# Altium project Sim800.PrjPcb
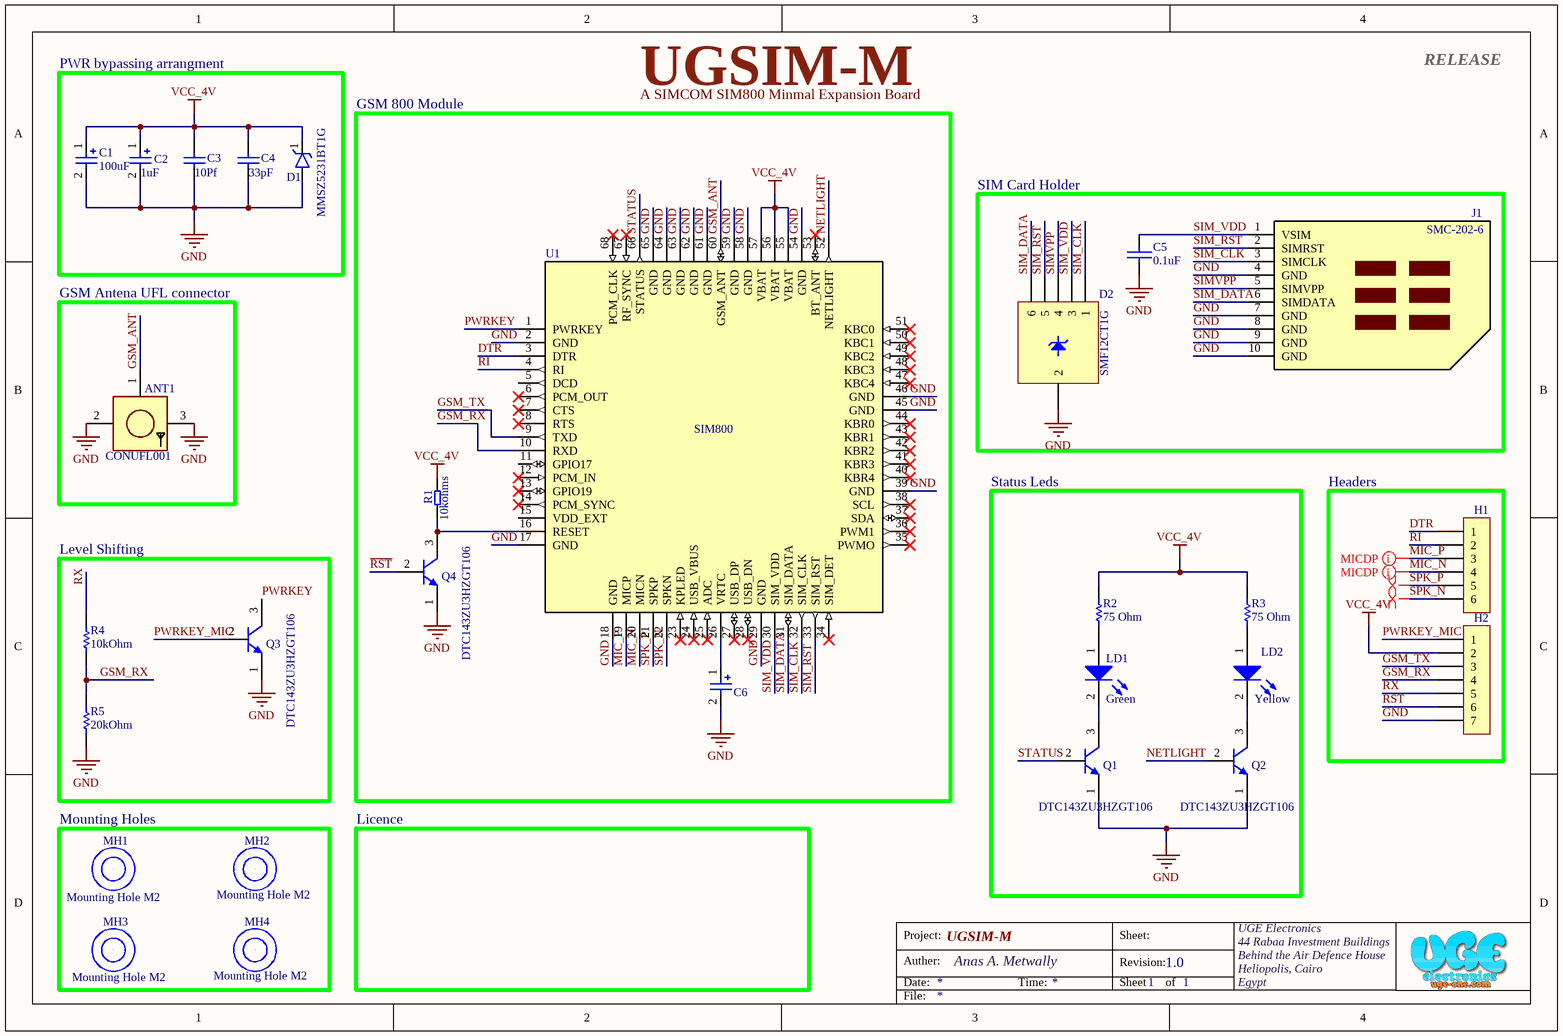
[diagram p0: Sim800.SchDoc]
1 sheet, 28 parts. Net scope: global (net labels, ports and power ports of the same name join across sheets).
Board file: sim800.PcbDoc

## Sheet Sim800.SchDoc: UGSIM-M
size A4; Author: Anas A.metwally; DrawnBy: Anas A.Metwally; Engineer: Anas A.Metwally; Organization: UGE Electronics; Address1: 44 Rabaa Investment Buildings; Address2: Behind the Air Defence House; Address3: Heliopolis, Cairo; Address4: Egypt; Revision: 1.0; SheetNumber: 1; SheetTotal: 1; Design Status: RELEASE

### Parts
ANT1  CONUFL001  [UFL]
C1  100uF  [Tanat Case D]
C2  1uF  [C1206]
C3  10Pf  [0603Cap]
C4  33pF
C5  0.1uF  [0603Cap]
C6  4.7uF  [C1206]  (value not drawn)
D1  MMSZ5231BT1G  [SOD-123]
D2  SMF12CT1G  [SOT-363]
H1  Heder 6X1  [Header6X1]  (value not drawn)
H2  Heder 7X1  [Header 7X1]  (value not drawn)
J1  SMC-202-6  [Micro SIM Connector]
LD1  Green  [0603D-G]
LD2  Yellow  [0603D-y]
MH1  Mounting Hole M2  [M2Hole]  (no BOM)
MH2  Mounting Hole M2  [M2Hole]  (no BOM)
MH3  Mounting Hole M2  [M2Hole]  (no BOM)
MH4  Mounting Hole M2  [M2Hole]  (no BOM)
Q1  DTC143ZU3HZGT106  [Sot 323]
Q2  DTC143ZU3HZGT106  [Sot 323]
Q3  DTC143ZU3HZGT106  [Sot 323]
Q4  DTC143ZU3HZGT106  [Sot 323]
R1  10kohms  [0603R]
R2  75 Ohm  [0603R]
R3  75 Ohm  [0603R]
R4  10kOhm  [0603R]
R5  20kOhm  [0603R]
U1  SIM800  [SIMCom_SIM800]

### Blocks framed on the sheet
PWR bypassing arrangment: C1-C4 D1
SIM Card Holder: C5 D2 J1
GSM Antena UFL connector: ANT1
Status Leds: LD1 LD2 Q1 Q2 R2 R3
Headers: H1 H2
Level Shifting: Q3 R4 R5
Mounting Holes: MH1-MH4

### Nets
GND: ANT1.2 ANT1.3 C1.2 C2.2 C3.1 C4.1 C5.2 C6.2 D1.2 D2.2 H2.7 J1.4(GND) J1.7(GND) J1.8(GND) J1.9(GND) J1.10(GND) Q1.1(E) Q2.1(E) Q3.1(E) Q4.1(E) R5.1 U1.2(GND) U1.17(GND) U1.18(GND) U1.29(GND) U1.39(GND) U1.45(GND) U1.46(GND) U1.54(GND) U1.58(GND) U1.59(GND) U1.61(GND) U1.62(GND) U1.63(GND) U1.64(GND) U1.65(GND)
VCC_4V: C1.1 C2.1 C3.2 C4.2 D1.1 H2.2 R1.2 R2.1 R3.1 U1.55(VBAT) U1.56(VBAT) U1.57(VBAT)
~{RST}: H2.6 Q4.2(B)
DTR: H1.1 U1.3(DTR)
GSM_ANT: ANT1.1 U1.60(GSM_ANT)
GSM_RX: H2.4 R4.1 R5.2 U1.10(RXD)
GSM_TX: H2.3 U1.9(TXD)
MIC_N: H1.4 U1.20(MICN)
MIC_P: H1.3 U1.19(MICP)
NETLIGHT: Q2.2(B) U1.52(NETLIGHT)
PWRKEY: Q3.3(C) U1.1(PWRKEY)
PWRKEY_MIC: H2.1 Q3.2(B)
RI: H1.2 U1.4(RI)
RX: H2.5 R4.2
SIM_CLK: D2.1 J1.3(SIMCLK) U1.32(SIM_CLK)
SIM_DATA: D2.6 J1.6(SIMDATA) U1.31(SIM_DATA)
SIM_RST: D2.5 J1.2(SIMRST) U1.33(SIM_RST)
SIM_VDD: C5.1 D2.3 J1.1(VSIM) U1.30(SIM_VDD)
SIMVPP: D2.4 J1.5(SIMVPP)
SPK_N: H1.6 U1.22(SPKN)
SPK_P: H1.5 U1.21(SPKP)
STATUS: Q1.2(B) U1.66(STATUS)
NetC6_1: C6.1 U1.26(VRTC)
NetLD1_1: LD1.1(A) R2.2
NetLD1_2: LD1.2(K) Q1.3(C)
NetLD2_1: LD2.1(A) R3.2
NetLD2_2: LD2.2(K) Q2.3(C)
NetQ4_3: Q4.3(C) R1.1 U1.16(RESET)

Not connected (* = marked no-connect by the designer): MH1 0; MH2 0; MH3 0; MH4 0; U1 5(DCD) 6(PCM_OUT)* 7(CTS)* 8(RTS)* 11(GPIO17) 12(PCM_IN)* 13(GPIO19)* 14(PCM_SYNC)* 15(VDD_EXT) 23(KPLED)* 24(USB_VBUS)* 25(ADC)* 27(USB_DP)* 28(USB_DN)* 34(SIM_DET)* 35(PWMO)* 36(PWM1)* 37(SDA)* 38(SCL)* 40(KBR4)* 41(KBR3)* 42(KBR2)* 43(KBR1)* 44(KBR0)* 47(KBC4)* 48(KBC3)* 49(KBC2)* 50(KBC1)* 51(KBC0)* 53(BT_ANT)* 67(RF_SYNC)* 68(PCM_CLK)*

### Layout directives
differential pair: MIC_N, MIC_P, SPK_N, SPK_P

### Notes on the sheet
- GSM 800 Module
- A SIMCOM SIM800 Minmal Expansion Board
- Licence
- Project:
- Auther:
- Date:
- Anas A. Metwally <anastien@outlook.com>
- Time:
- Sheet:
- Revision:
- Sheet
- of
- UGE Electronics <https://uge-one.com/>
- 44 Rabaa Investment Buildings
- Behind the Air Defence House
- Heliopolis, Cairo
- Egypt
- File:

### Library data of the parts
ANT1 = CONUFL001-SMD-T: CONN UMC JACK STR SMD; Manufacturer: Linx; Supplier 1: Mouser; Manufacturer Part Number: CONUFL001-SMD-T; Stock 1: 8451; Pricing 1: 1 = 0.62000, 10 = 0.59000, 50 = 0.57000, 100 = 0.53000, 1000 = 0.44000, 10000 = 0.37800 (USD); RoHS: No; ComponentLink1URL: https://media.digikey.com/pdf/Data%20Sheets/Linx%20Technologies%20PDFs/CONUFL001-SMD_T_Dwg_RevB_5-15-17.pdf?src-supplier=Digi-Key; ComponentLink1Description: https://media.digikey.com/pdf/Data%20Sheets/Linx%20Technologies%20PDFs/CONUFL001-SMD_T_Dwg_RevB_5-15-17.pdf?src-supplier=Digi-Key; Supplier Part Number 1: 712-CONUFL001-SMD-T
C1 = Cap 100uF Tant: Manufacturer: Kyocera AVX; Manufacturer Part Number: TAJA105K035TNJ; Voltage Rating (DC): 25V; Tolerance: 20%; Stock 1: 22047; Pricing 1: 1 = 0.43000, 10 = 0.29700, 50 = 0.29700, 100 = 0.13400, 1000 = 0.11300, 2000 = 0.09300, 10000 = 0.09300 (USD); RoHS: No; ComponentLink1URL: http://datasheets.avx.com/TAJ_AUTO.pdf?src-supplier=Digi-Key; ComponentLink1Description: http://datasheets.avx.com/TAJ_AUTO.pdf?src-supplier=Digi-Key; Stock 2: 1935; Pricing 2: 1 = 3.18000, 10 = 2.57000, 50 = 2.57000, 100 = 1.96000, 250 = 1.59000, 500 = 1.46000, 1000 = 1.28000, 1500 = 1.10000, 4500 = 1.06000, 9000 = 1.05000, 10000 = 1.06000 (USD); Capacitance: 100uF; Lead Free: Lead Free
C2 = Cap 1uF Tant 1206: 1µF Molded Tantalum Capacitors 35V 1206 (3216 Metric) 7.5Ohm @ 100kHz; Manufacturer: Kyocera AVX; Manufacturer Part Number: TAJA105K035TNJ; Stock 1: 22047; Pricing 1: 1 = 0.43000, 10 = 0.29700, 50 = 0.29700, 100 = 0.13400, 1000 = 0.11300, 2000 = 0.09300, 10000 = 0.09300 (USD); RoHS: No; ComponentLink1URL: http://datasheets.avx.com/TAJ_AUTO.pdf?src-supplier=Digi-Key; ComponentLink1Description: http://datasheets.avx.com/TAJ_AUTO.pdf?src-supplier=Digi-Key; Supplier 1: Mouser; Supplier Part Number 1: 581-TAJA105K035TNJ
C3 = Cap 10pf 0603: Multilayer Ceramic Capacitors MLCC - SMD/SMT 16V 10pF 0603 X7R 0.1; Manufacturer: KEMET; Manufacturer Part Number: C0603C100K4RACTU; Supplier 1: Mouser; Stock 1: 14682; Pricing 1: 1 = 0.24000, 10 = 0.12500, 50 = 0.12500, 100 = 0.07600, 1000 = 0.05900, 10000 = 0.04200 (USD); RoHS: No; Supplier Part Number 1: 80-C0603C100K4RACTU
C4 = Cap 33pF 0603: Multilayer Ceramic Capacitors MLCC - SMD/SMT 50V 33pF 0603 X8R 20%; Manufacturer: KEMET; Manufacturer Part Number: C0603C330M5HACTU; Supplier 1: Mouser; Stock 1: 39000; Pricing 1: 1 = 0.10000, 10 = 0.01700, 50 = 0.01700, 100 = 0.01200, 1000 = 0.00800, 10000 = 0.00600 (USD); RoHS: No; Supplier Part Number 1: 80-C0603C330M5HACTU
C5 = Cap 0.1uF 50V 0603 X7R: Cap Ceramic 0.1uF 50V X7R 5% SMD 0603 125C Paper T/R. CC0603JPX7R9BB104; Manufacturer: Yageo; Capacitance: 100nF; Supplier 1: Mouser; Manufacturer Part Number: CC0603JPX7R9BB104; Stock 1: 581901; Pricing 1: 1 = 0.13000, 10 = 0.06800, 50 = 0.06800, 100 = 0.03100, 1000 = 0.02500, 2500 = 0.01900, 10000 = 0.01800, 15000 = 0.01700, 45000 = 0.01600, 90000 = 0.01300 (USD); RoHS: Yes; Case/Package: 0603; Min Operating Temperature: -55°C; Max Operating Temperature: 125°C; Tolerance: 5%; Packaging: Tape and Reel; Dielectric: X7R; Length: 1.6mm; Depth: 0.8mm; ComponentLink1URL: http://components.arrow.com/part/dataview/0323_02951817?src-supplier=Arrow+Europe; ComponentLink1Description: http://components.arrow.com/part/dataview/0323_02951817?src-supplier=Arrow+Europe; Supplier Part Number 1: 603-CC0603JPX79BB104
C6 = Cap 4.7uF tantalum: CAP TANT 4.7UF 10% 16V 1206,TAJA475K016RNJ; Manufacturer: Kyocera AVX; ESR (Equivalent Series Resistance): 4R; Leakage Current: 800nA; Polarity: Polar; Dissipation Factor: 6%; Manufacturer Part Number: TAJA475K016RNJ; Stock 1: 424346; Pricing 1: 1 = 0.41000, 10 = 0.28200, 100 = 0.16910, 500 = 0.12678, 1000 = 0.10707 (USD); RoHS: Yes; Mount: Surface Mount; Case/Package: 1206; Number of Pins: 2; Case Code (Metric): 3216; Case Code (Imperial): 1206; Dielectric Material: Tantalum; Min Operating Temperature: -55°C; Max Operating Temperature: 125°C; Package Quantity: 1; Capacitance: 4.7uF; Voltage Rating: 16V; Tolerance: 10%; Packaging: Tape and Reel; Voltage Rating (DC): 16V; Termination: SMD/SMT; Voltage: 16V; Features: General Purpose; Length: 3.2mm; Height: 1.6mm; Width: 1.6mm; Height - Seated (Max): 0.071inch; Depth: 1.6mm; Lead Pitch: 1.1mm; Radiation Hardening: No; REACH SVHC: No SVHC; Lead Free: Lead Free; ComponentLink1URL: https://datasheet.ciiva.com/26341/559419-da-01-en-tacc-a-3-2-mm-x-1-6-mm-x-1-6-mm-4-7-uf-26341760.pdf?src-supplier=Conrad; ComponentLink1Description: https://datasheet.ciiva.com/26341/559419-da-01-en-tacc-a-3-2-mm-x-1-6-mm-x-1-6-mm-4-7-uf-26341760.pdf?src-supplier=Conrad; ComponentLink2URL: https://datasheet.ciiva.com/263/taj-263377.pdf?src-supplier=Digi-Key; ComponentLink2Description: https://datasheet.ciiva.com/263/taj-263377.pdf?src-supplier=Digi-Key; ComponentLink3URL: https://datasheet.ciiva.com/263/taj-263378.pdf?src-supplier=Digi-Key; ComponentLink3Description: https://datasheet.ciiva.com/263/taj-263378.pdf?src-supplier=Digi-Key; ComponentLink4URL: https://datasheet.ciiva.com/14604/70001050-14604501.pdf?src-supplier=Allied+Electronics; ComponentLink4Description: https://datasheet.ciiva.com/14604/70001050-14604501.pdf?src-supplier=Allied+Electronics; ComponentLink5URL: https://datasheet.ciiva.com/18710/taj-eng-18710646.pdf?src-supplier=Distrelec; ComponentLink5Description: https://datasheet.ciiva.com/18710/taj-eng-18710646.pdf?src-supplier=Distrelec; ComponentLink6URL: https://datasheet.ciiva.com/3004/taj-3004411.pdf?src-supplier=Avnet; ComponentLink6Description: https://datasheet.ciiva.com/3004/taj-3004411.pdf?src-supplier=Avnet; ComponentLink7URL: https://datasheet.ciiva.com/3004/taj-3004412.pdf?src-supplier=Avnet; ComponentLink7Description: https://datasheet.ciiva.com/3004/taj-3004412.pdf?src-supplier=Avnet; ComponentLink8URL: https://datasheet.ciiva.com/7914/taj-7914556.pdf?src-supplier=Element14; ComponentLink8Description: https://datasheet.ciiva.com/7914/taj-7914556.pdf?src-supplier=Element14; ComponentLink9URL: https://datasheet.ciiva.com/5934/13070-5934925.pdf?src-supplier=Farnell; ComponentLink9Description: https://datasheet.ciiva.com/5934/13070-5934925.pdf?src-supplier=Farnell; ComponentLink10URL: https://datasheet.ciiva.com/16199/taj-16199151.pdf?src-supplier=Future+Electronics; ComponentLink10Description: https://datasheet.ciiva.com/16199/taj-16199151.pdf?src-supplier=Future+Electronics; ComponentLink11URL: https://datasheet.ciiva.com/263/taj-263376.pdf?src-supplier=Digi-Key; ComponentLink11Description: https://datasheet.ciiva.com/263/taj-263376.pdf?src-supplier=Digi-Key; ComponentLink12URL: https://datasheet.ciiva.com/12883/taj-27497-12883126.pdf?src-supplier=Mouser; ComponentLink12Description: https://datasheet.ciiva.com/12883/taj-27497-12883126.pdf?src-supplier=Mouser; ComponentLink13URL: https://datasheet.ciiva.com/14608/70001050-14608696.pdf?src-supplier=Allied+Electronics; ComponentLink13Description: https://datasheet.ciiva.com/14608/70001050-14608696.pdf?src-supplier=Allied+Electronics; ComponentLink14URL: https://datasheet.ciiva.com/7914/1680476-7914555.pdf?src-supplier=Element14; ComponentLink14Description: https://datasheet.ciiva.com/7914/1680476-7914555.pdf?src-supplier=Element14; Supplier 1: Mouser; Supplier Part Number 1: 581-TAJA475K016R
D1 = MMSZ5231BT1G: DIODE ZENER 5.1V 500MW SOD123; Manufacturer: ON Semiconductor; Material: Plastic; Tolerance: 5%; Forward Voltage: 900mV; Impedance: 17R; Max Reverse Leakage Current: 5uA; Zener Current: 10mA; Test Current: 20mA; Element Configuration: Single; Breakdown Voltage: 5.36V; Supplier 1: Mouser; Manufacturer Part Number: MMSZ5231BT1G; Stock 1: 48448; Pricing 1: 1 = 0.20000, 10 = 0.18900, 50 = 0.18900, 100 = 0.06600, 1000 = 0.04400, 3000 = 0.03300, 9000 = 0.02900, 10000 = 0.02900, 24000 = 0.02600, 45000 = 0.02300, 99000 = 0.02100 (USD); RoHS: Yes; Case/Package: SOD-123-2; Number of Pins: 2; Min Operating Temperature: -55°C; Max Operating Temperature: 150°C; Max Power Dissipation: 500mW; Package Quantity: 1; Packaging: Tape and Reel; Zener Voltage: 5.1V; Voltage Tolerance: 5%; Power Dissipation: 500mW; Working Voltage: 5.1V; Peak Reverse Current: 5uA; Voltage Rating (DC): 5.1V; Power Rating: 500mW; Length: 0.111inch; Height: 0.053inch; Width: 0.071inch; Radiation Hardening: No; REACH SVHC: No SVHC; Lead Free: Lead Free; ComponentLink1URL: https://datasheet.ciiva.com/23815/1708301-23815376.pdf?src-supplier=Newark; ComponentLink1Description: https://datasheet.ciiva.com/23815/1708301-23815376.pdf?src-supplier=Newark; ComponentLink2URL: https://datasheet.ciiva.com/894/mmsz5221bt1-d-894881.pdf?src-supplier=Digi-Key; ComponentLink2Description: https://datasheet.ciiva.com/894/mmsz5221bt1-d-894881.pdf?src-supplier=Digi-Key; ComponentLink3URL: https://datasheet.ciiva.com/894/mmsz5221bt1-d-894882.pdf?src-supplier=Digi-Key; ComponentLink3Description: https://datasheet.ciiva.com/894/mmsz5221bt1-d-894882.pdf?src-supplier=Digi-Key; ComponentLink4URL: https://datasheet.ciiva.com/894/mmsz5221bt1-d-894883.pdf?src-supplier=Digi-Key; ComponentLink4Description: https://datasheet.ciiva.com/894/mmsz5221bt1-d-894883.pdf?src-supplier=Digi-Key; ComponentLink5URL: https://datasheet.ciiva.com/16200/mmsz5221bt1-d-16200104.pdf?src-supplier=Future+Electronics; ComponentLink5Description: https://datasheet.ciiva.com/16200/mmsz5221bt1-d-16200104.pdf?src-supplier=Future+Electronics; ComponentLink6URL: https://datasheet.ciiva.com/4731/mmsz5221bt1-d-4731452.pdf?src-supplier=Mouser; ComponentLink6Description: https://datasheet.ciiva.com/4731/mmsz5221bt1-d-4731452.pdf?src-supplier=Mouser; ComponentLink7URL: https://datasheet.ciiva.com/22626/1708301-22626967.pdf?src-supplier=Element14; ComponentLink7Description: https://datasheet.ciiva.com/22626/1708301-22626967.pdf?src-supplier=Element14; ComponentLink8URL: https://datasheet.ciiva.com/25928/mmsz5221bt1-d-25928103.pdf?src-supplier=Avnet+Europe; ComponentLink8Description: https://datasheet.ciiva.com/25928/mmsz5221bt1-d-25928103.pdf?src-supplier=Avnet+Europe; Supplier Part Number 1: 863-MMSZ5231BT1G
D2 = SMF12CT1G: TVS DIODE 12V 23V SC88; Manufacturer: ON Semiconductor; Direction: Unidirectional; Breakdown Voltage: 13.3V; Leakage Current: 100nA; Max Surge Current: 6A; Number of Channels: 5; Peak Pulse Power: 100W; Power Line Protection: No; Max Breakdown Voltage: 7.2V; Element Configuration: Common Anode; ESD Protection: Yes; Test Current: 1mA; Max Reverse Leakage Current: 5uA; Supplier 1: Mouser; Manufacturer Part Number: SMF12CT1G; Stock 1: 7670; Pricing 1: 1 = 0.46000, 10 = 0.32200, 50 = 0.32200, 100 = 0.14800, 1000 = 0.11400, 3000 = 0.09700, 9000 = 0.08900, 10000 = 0.08900, 24000 = 0.08300, 45000 = 0.07400, 99000 = 0.07100 (USD); RoHS: Yes; Case/Package: SC; Number of Pins: 6; Contact Plating: Tin,Matte; Min Operating Temperature: -40°C; Max Operating Temperature: 125°C; Package Quantity: 1; Packaging: Tape and Reel; Polarity: Unidirectional; Clamping Voltage: 23V; Reverse Standoff Voltage: 12V; Working Voltage: 12V; Operating Supply Voltage: 12V; Termination: SMD/SMT; Number of Unidirectional Channels: 5; Min Breakdown Voltage: 13.3V; Power Dissipation: 100W; Voltage Rating (DC): 12V; Peak Pulse Current: 6A; Composition: Zener; Length: 2mm; Height: 1mm; Depth: 1.25mm; Width: 1.35mm; Radiation Hardening: No; Lead Free: Lead Free; ComponentLink1URL: https://datasheet.ciiva.com/4513/smf05c-d-100912-4513248.pdf?src-supplier=Mouser; ComponentLink1Description: https://datasheet.ciiva.com/4513/smf05c-d-100912-4513248.pdf?src-supplier=Mouser; ComponentLink2URL: https://datasheet.ciiva.com/25957/smf05c-d-25957369.pdf?src-supplier=Avnet+Europe; ComponentLink2Description: https://datasheet.ciiva.com/25957/smf05c-d-25957369.pdf?src-supplier=Avnet+Europe; ComponentLink3URL: https://datasheet.ciiva.com/11193/smf05c-d-11193402.pdf?src-supplier=Avnet; ComponentLink3Description: https://datasheet.ciiva.com/11193/smf05c-d-11193402.pdf?src-supplier=Avnet; ComponentLink4URL: https://datasheet.ciiva.com/353/smf05c-d-353902.pdf?src-supplier=Digi-Key; ComponentLink4Description: https://datasheet.ciiva.com/353/smf05c-d-353902.pdf?src-supplier=Digi-Key; ComponentLink5URL: https://datasheet.ciiva.com/353/smf05c-d-353903.pdf?src-supplier=Digi-Key; ComponentLink5Description: https://datasheet.ciiva.com/353/smf05c-d-353903.pdf?src-supplier=Digi-Key; Supplier Part Number 1: 863-SMF12CT1G
J1 = Micro Sim Connector: ComponentLink1Description: on aliexpress; ComponentLink1URL: https://www.aliexpress.com/item/32960690078.html?spm=a2g0o.productlist.0.0.735f2bb6q422g4&algo_pvid=1909d03e-9bfc-4d5c-b848-f6211606a0a0&algo_expid=1909d03e-9bfc-4d5c-b848-f6211606a0a0-4&btsid=6ccb498c-0190-470a-a4c7-741ec023e9fd&ws_ab_test=searchweb0_0,searchweb201602_,searchweb201603_53
LD1 = LED Green: LED GREEN DIFFUSED 0603 SMD; Manufacturer: Rohm; Manufacturer Part Number: SML-D12M8WT86; Lens Color: White; Forward Current: 20mA; Forward Voltage: 2.2V; Luminous Intensity: 25mcd; Viewing Angle: 160°; Dominant Wavelength: 572nm; Number of LEDs: 1; Supplier 1: Digi-Key; Stock 1: 140294; Pricing 1: 1 = 0.34000, 10 = 0.25100, 25 = 0.18480, 100 = 0.13200, 250 = 0.08976, 500 = 0.07920, 1000 = 0.06204 (USD); RoHS: Yes; Mount: Surface Mount; Case/Package: 0603; Number of Pins: 2; Color: Green; Case Code (Metric): 1608; Case Code (Imperial): 0603; Min Operating Temperature: -40°C; Max Operating Temperature: 85°C; Illumination Color: Green; Packaging: Tape and Reel; Lens Style: Diffused; Package Quantity: 1; Test Current: 20mA; Lens Transparency: Diffused; Wavelength: 572nm; Length: 1.6mm; Height: 0.65mm; Width: 0.8mm; Radiation Hardening: No; REACH SVHC: Unknown; Lead Free: Lead Free; ComponentLink1URL: https://datasheet.ciiva.com/11774/0900766b80df3ada-11774260.pdf?src-supplier=RSComponents; ComponentLink1Description: https://datasheet.ciiva.com/11774/0900766b80df3ada-11774260.pdf?src-supplier=RSComponents; ComponentLink2URL: https://datasheet.ciiva.com/3161/sml-d1-3161419.pdf?src-supplier=Avnet; ComponentLink2Description: https://datasheet.ciiva.com/3161/sml-d1-3161419.pdf?src-supplier=Avnet; ComponentLink3URL: https://datasheet.ciiva.com/2110/sml-d1-2110396.pdf?src-supplier=Digi-Key; ComponentLink3Description: https://datasheet.ciiva.com/2110/sml-d1-2110396.pdf?src-supplier=Digi-Key; ComponentLink4URL: https://datasheet.ciiva.com/2110/sml-d1-2110397.pdf?src-supplier=Digi-Key; ComponentLink4Description: https://datasheet.ciiva.com/2110/sml-d1-2110397.pdf?src-supplier=Digi-Key; ComponentLink5URL: https://datasheet.ciiva.com/2110/sml-d1-2110398.pdf?src-supplier=Digi-Key; ComponentLink5Description: https://datasheet.ciiva.com/2110/sml-d1-2110398.pdf?src-supplier=Digi-Key; Supplier Part Number 1: 511-1578-1-ND
LD2 = LED Yellow: LED YELLOW DIFFUSED 0603 SMD; Manufacturer: Rohm; Manufacturer Part Number: SML-D12Y8WT86; Lens Color: White; Lens Style: Rectangular; Forward Voltage: 2.2V; Luminous Intensity: 63mcd; Forward Current: 20mA; Viewing Angle: 160°; Dominant Wavelength: 590nm; Number of LEDs: 1; Stock 1: 214; Pricing 1: 1 = 0.34000, 10 = 0.25100, 25 = 0.18480, 100 = 0.13200, 250 = 0.08976, 500 = 0.07920, 1000 = 0.06204 (USD); RoHS: Yes; Mount: Surface Mount; Case/Package: 0603; Number of Pins: 2; Color: Yellow; Case Code (Metric): 1608; Case Code (Imperial): 0603; Min Operating Temperature: -40°C; Max Operating Temperature: 85°C; Package Quantity: 1; Packaging: Tape and Reel; Illumination Color: Yellow; Test Current: 20mA; Lens Transparency: Diffused; Wavelength: 590nm; Length: 1.6mm; Height: 0.65mm; Width: 0.8mm; Radiation Hardening: No; Lead Free: Lead Free; ComponentLink1URL: https://datasheet.ciiva.com/11774/0900766b80df3ada-11774475.pdf?src-supplier=RSComponents; ComponentLink1Description: https://datasheet.ciiva.com/11774/0900766b80df3ada-11774475.pdf?src-supplier=RSComponents; ComponentLink2URL: https://datasheet.ciiva.com/17419/sml-d1-17419897.pdf?src-supplier=Avnet+Europe; ComponentLink2Description: https://datasheet.ciiva.com/17419/sml-d1-17419897.pdf?src-supplier=Avnet+Europe; ComponentLink3URL: https://datasheet.ciiva.com/2115/sml-d1-2115067.pdf?src-supplier=Digi-Key; ComponentLink3Description: https://datasheet.ciiva.com/2115/sml-d1-2115067.pdf?src-supplier=Digi-Key; ComponentLink4URL: https://datasheet.ciiva.com/2115/sml-d1-2115068.pdf?src-supplier=Digi-Key; ComponentLink4Description: https://datasheet.ciiva.com/2115/sml-d1-2115068.pdf?src-supplier=Digi-Key; ComponentLink5URL: https://datasheet.ciiva.com/2115/sml-d1-2115069.pdf?src-supplier=Digi-Key; ComponentLink5Description: https://datasheet.ciiva.com/2115/sml-d1-2115069.pdf?src-supplier=Digi-Key; ComponentLink6URL: https://datasheet.ciiva.com/3161/sml-d1-3161421.pdf?src-supplier=Avnet; ComponentLink6Description: https://datasheet.ciiva.com/3161/sml-d1-3161421.pdf?src-supplier=Avnet; ComponentLink7URL: https://datasheet.ciiva.com/16289/sml-d1-16289838.pdf?src-supplier=Future+Electronics; ComponentLink7Description: https://datasheet.ciiva.com/16289/sml-d1-16289838.pdf?src-supplier=Future+Electronics; Supplier 1: Mouser; Supplier Part Number 1: 755-SML-D12Y8WT86
MH1-MH4 = M2Hole
Q1-Q4 = NPN Transistor Prebaised: Manufacturer: Rohm; Supplier 1: Mouser; Manufacturer Part Number: DTC143ZU3HZGT106; Stock 1: 4628; Pricing 1: 1 = 0.32000, 10 = 0.21600, 50 = 0.21600, 100 = 0.09000, 1000 = 0.06200, 3000 = 0.04800, 10000 = 0.04800 (USD); RoHS: No; Supplier Part Number 1: 755-DTC143ZU3HZGT106
R1 = Res 10Kohms
R2 R3 = RES 75 Ohm 0603: Manufacturer: Rohm; Manufacturer Part Number: ESR03EZPJ131; Resistance: 130R; Tolerance: 5%; Temperature Coefficient: 200ppm/°C; Max Power Dissipation: 250mW; Supplier 1: Mouser; Stock 1: 12117; Pricing 1: 1 = 0.10000, 10 = 0.07100, 50 = 0.07100, 100 = 0.02500, 1000 = 0.01700, 10000 = 0.01100 (USD); RoHS: Yes; Case/Package: 0603; Case Code (Metric): 1608; Case Code (Imperial): 0603; Min Operating Temperature: -55°C; Max Operating Temperature: 155°C; Package Quantity: 1; Packaging: Tape and Reel; Composition: Thick Film; Number of Terminations: 2; Features: Automotive AEC-Q200; Length: 0.063inch; Height: 0.022inch; Width: 0.031inch; ComponentLink1URL: https://datasheet.ciiva.com/2515/esr-2515857.pdf?src-supplier=Digi-Key; ComponentLink1Description: https://datasheet.ciiva.com/2515/esr-2515857.pdf?src-supplier=Digi-Key; ComponentLink2URL: https://datasheet.ciiva.com/2515/esr-2515858.pdf?src-supplier=Digi-Key; ComponentLink2Description: https://datasheet.ciiva.com/2515/esr-2515858.pdf?src-supplier=Digi-Key; ComponentLink3URL: https://datasheet.ciiva.com/2515/esr-2515859.pdf?src-supplier=Digi-Key; ComponentLink3Description: https://datasheet.ciiva.com/2515/esr-2515859.pdf?src-supplier=Digi-Key; Supplier Part Number 1: 755-ESR03EZPJ131
R4 = RES 10kOhms 0603: RES SMD 10K OHM 1% 1/4W 0603; Manufacturer: Rohm; Manufacturer Part Number: ESR03EZPF1002; Resistance: 10kR; Power Rating: 250mW; Temperature Coefficient: 100ppm/°C; Stock 1: 222376; Pricing 1: 1 = 0.13000, 10 = 0.12000, 100 = 0.04620, 1000 = 0.02033, 2500 = 0.01756 (USD); RoHS: Yes; Case/Package: 0603; Case Code (Metric): 1608; Case Code (Imperial): 0603; Min Operating Temperature: -55°C; Max Operating Temperature: 155°C; Tolerance: 1%; Package Quantity: 1; Packaging: Tape and Reel; Composition: Thick Film; Number of Terminations: 2; Max Power Dissipation: 250mW; Features: Automotive AEC-Q200; Length: 0.063inch; Height: 0.022inch; Width: 0.031inch; Lead Free: Lead Free; ComponentLink1URL: https://datasheet.ciiva.com/2469/esr-2469709.pdf?src-supplier=Digi-Key; ComponentLink1Description: https://datasheet.ciiva.com/2469/esr-2469709.pdf?src-supplier=Digi-Key; ComponentLink2URL: https://datasheet.ciiva.com/2469/esr-2469710.pdf?src-supplier=Digi-Key; ComponentLink2Description: https://datasheet.ciiva.com/2469/esr-2469710.pdf?src-supplier=Digi-Key; ComponentLink3URL: https://datasheet.ciiva.com/2469/esr-2469711.pdf?src-supplier=Digi-Key; ComponentLink3Description: https://datasheet.ciiva.com/2469/esr-2469711.pdf?src-supplier=Digi-Key; Supplier 1: Mouser; Supplier Part Number 1: 755-ESR03EZPF1002
R5 = RES 20kOhms 0603: RES SMD 10K OHM 1% 1/4W 0603; Manufacturer: Rohm; Manufacturer Part Number: ESR03EZPF1002; Resistance: 10kR; Power Rating: 250mW; Temperature Coefficient: 100ppm/°C; Stock 1: 222376; Pricing 1: 1 = 0.13000, 10 = 0.12000, 100 = 0.04620, 1000 = 0.02033, 2500 = 0.01756 (USD); RoHS: Yes; Case/Package: 0603; Case Code (Metric): 1608; Case Code (Imperial): 0603; Min Operating Temperature: -55°C; Max Operating Temperature: 155°C; Tolerance: 1%; Package Quantity: 1; Packaging: Tape and Reel; Composition: Thick Film; Number of Terminations: 2; Max Power Dissipation: 250mW; Features: Automotive AEC-Q200; Length: 0.063inch; Height: 0.022inch; Width: 0.031inch; Lead Free: Lead Free; ComponentLink1URL: https://datasheet.ciiva.com/2469/esr-2469709.pdf?src-supplier=Digi-Key; ComponentLink1Description: https://datasheet.ciiva.com/2469/esr-2469709.pdf?src-supplier=Digi-Key; ComponentLink2URL: https://datasheet.ciiva.com/2469/esr-2469710.pdf?src-supplier=Digi-Key; ComponentLink2Description: https://datasheet.ciiva.com/2469/esr-2469710.pdf?src-supplier=Digi-Key; ComponentLink3URL: https://datasheet.ciiva.com/2469/esr-2469711.pdf?src-supplier=Digi-Key; ComponentLink3Description: https://datasheet.ciiva.com/2469/esr-2469711.pdf?src-supplier=Digi-Key; Supplier 1: Mouser; Supplier Part Number 1: 755-ESR03EZPF1002
U1 = SIM800: complete Quad-band GSM/GPRS solution in a SMT type which can be embedded in the customer applications.; ComponentLink1Description: Component Link; ComponentLink1URL: https://simcom.ee/modules/gsm-gprs/sim800/